# Altium schematic sheet Pinto.SchDoc
size A; SheetNumber: 1; SheetTotal: 2
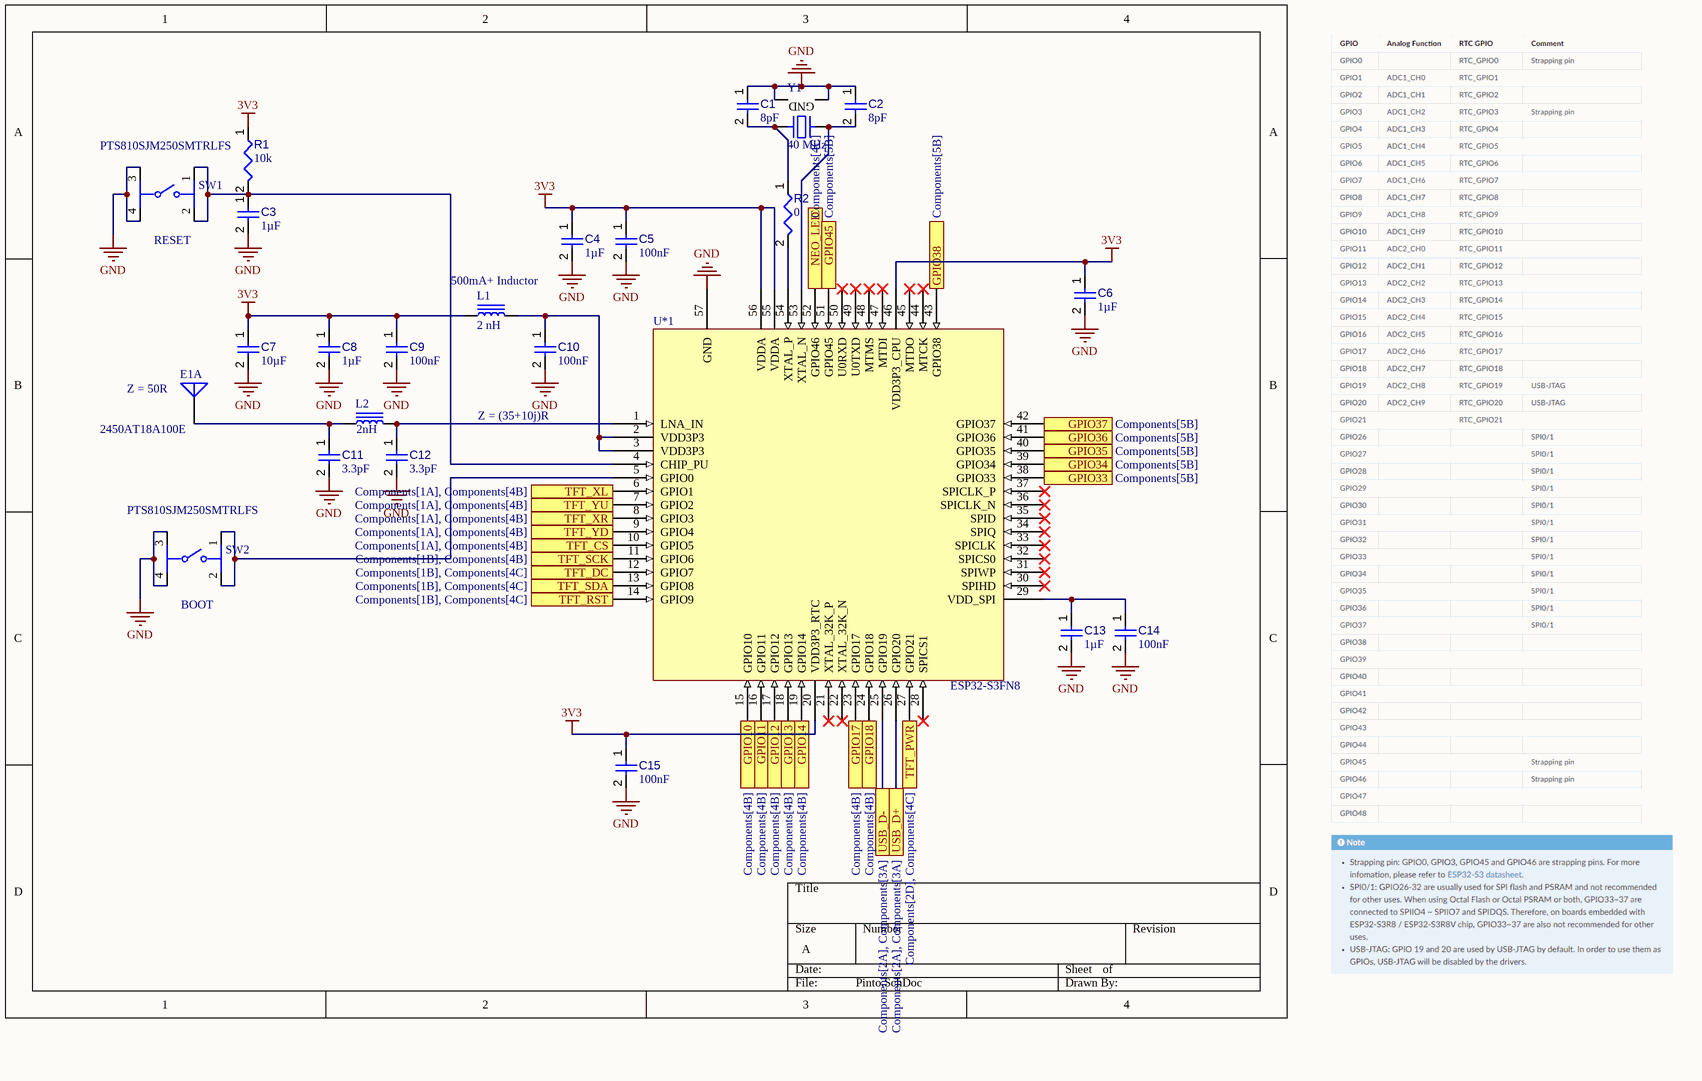
[diagram p0: Pinto.SchDoc]

## Parts
C1  value 8pF  [CAPC0402(1005)33_L]  (hidden comment: Capacitor 12pF +/-10% 50V 0402)
C2  value 8pF  [CAPC0402(1005)33_L]  (hidden comment: Capacitor 12pF +/-10% 50V 0402)
C3  value 1µF  [CAPC0402(1005)60_L]  (hidden comment: Capacitor 1µF +/-20% 10V 0402)
C4  value 1µF  [CAPC0402(1005)60_L]  (hidden comment: Capacitor 1µF +/-20% 10V 0402)
C5  value 100nF  [CAPC0402(1005)60_L]  (hidden comment: Capacitor 100nF +/-20% 10V 0402)
C6  value 1µF  [CAPC0402(1005)60_L]  (hidden comment: Capacitor 1µF +/-20% 10V 0402)
C7  value 10µF  [CAPC0402(1005)60_L]  (hidden comment: Capacitor 10µF +/-40% 6.3V 0402)
C8  value 1µF  [CAPC0402(1005)60_L]  (hidden comment: Capacitor 1µF +/-20% 10V 0402)
C9  value 100nF  [CAPC0402(1005)60_L]  (hidden comment: Capacitor 100nF +/-20% 10V 0402)
C10  value 100nF  [CAPC0402(1005)60_L]  (hidden comment: Capacitor 100nF +/-20% 10V 0402)
C11  value 3.3pF  [CAPC1005X56X25LL10T15]  (hidden comment: Capacitor 0.1 uF +/- 5% 16 V 0402)
C12  value 3.3pF  [CAPC1005X56X25LL10T15]  (hidden comment: Capacitor 0.1 uF +/- 5% 16 V 0402)
C13  value 1µF  [CAPC0402(1005)60_L]  (hidden comment: Capacitor 1µF +/-20% 10V 0402)
C14  value 100nF  [CAPC0402(1005)60_L]  (hidden comment: Capacitor 100nF +/-20% 10V 0402)
C15  value 100nF  [CAPC0402(1005)60_L]  (hidden comment: Capacitor 100nF +/-20% 10V 0402)
E1  2450AT18A100E  [JT-2450AT18A100-2_V]  (part A of 2)
L1  2 nH  [IND 0201_0603]
L2  2nH  [IND 0201_0603]
R1  value 10k  [RESC0402(1005)_L]  (hidden comment: 10KR2F)
R2  value 0  [RESC0402(1005)_L]  (hidden comment: 0R2J)
SW1  PTS810SJM250SMTRLFS  [FP-PTS810SJM250SMTRLFS-MFG]
SW2  PTS810SJM250SMTRLFS  [FP-PTS810SJM250SMTRLFS-MFG]
U*1  ESP32-S3FN8  [PCBComponent_1]
Y1  40 MHz  [NDK NX3225SA]

## Ports
GPIO10 (see Components[4B]), GPIO11 (see Components[4B]), GPIO12 (see Components[4B]), GPIO13 (see Components[4B]), GPIO14 (see Components[4B]), GPIO17 (see Components[4B]), GPIO18 (see Components[4B]), GPIO33 (see Components[5B]), GPIO34 (see Components[5B]), GPIO35 (see Components[5B]), GPIO36 (see Components[5B]), GPIO37 (see Components[5B]), GPIO38 (see Components[5B]), GPIO45 (see Components[5B]), NEO_LED (see Components[4C]), TFT_CS (see Components[1A], Components[4B]), TFT_DC (see Components[1B], Components[4C]), TFT_PWR (see Components[2D], Components[4C]), TFT_RST (see Components[1B], Components[4C]), TFT_SCK (see Components[1B], Components[4B]), TFT_SDA (see Components[1B], Components[4C]), TFT_XL (see Components[1A], Components[4B]), TFT_XR (see Components[1A], Components[4B]), TFT_YD (see Components[1A], Components[4B]), TFT_YU (see Components[1A], Components[4B]), USB_D+ (see Components[2A], Components[3A]), USB_D- (see Components[2A], Components[3A])

## Nets
3V3: C4.1 C5.1 C6.1 C7.1 C8.1 C9.1 C15.1 L1.1 R1.1 U*1.20(VDD3P3_RTC) U*1.46(VDD3P3_CPU) U*1.55(VDDA) U*1.56(VDDA)
GND: C1.1 C2.1 C3.2 C4.2 C5.2 C6.2 C7.2 C8.2 C9.2 C10.2 C11.2 C12.2 C13.2 C14.2 C15.2 SW1.3 SW1.4 SW2.3 SW2.4 U*1.57(GND) Y1.2(GND) Y1.4(GND)
GPIO10: U*1.15(GPIO10) ; port GPIO10
GPIO11: U*1.16(GPIO11) ; port GPIO11
GPIO12: U*1.17(GPIO12) ; port GPIO12
GPIO13: U*1.18(GPIO13) ; port GPIO13
GPIO14: U*1.19(GPIO14) ; port GPIO14
GPIO17: U*1.23(GPIO17) ; port GPIO17
GPIO18: U*1.24(GPIO18) ; port GPIO18
GPIO33: U*1.38(GPIO33) ; port GPIO33
GPIO34: U*1.39(GPIO34) ; port GPIO34
GPIO35: U*1.40(GPIO35) ; port GPIO35
GPIO36: U*1.41(GPIO36) ; port GPIO36
GPIO37: U*1.42(GPIO37) ; port GPIO37
GPIO38: U*1.43(GPIO38) ; port GPIO38
GPIO45: U*1.51(GPIO45) ; port GPIO45
NEO_LED: U*1.52(GPIO46) ; port NEO_LED
TFT_CS: U*1.10(GPIO5) ; port TFT_CS
TFT_DC: U*1.12(GPIO7) ; port TFT_DC
TFT_PWR: U*1.27(GPIO21) ; port TFT_PWR
TFT_RST: U*1.14(GPIO9) ; port TFT_RST
TFT_SCK: U*1.11(GPIO6) ; port TFT_SCK
TFT_SDA: U*1.13(GPIO8) ; port TFT_SDA
TFT_XL: U*1.6(GPIO1) ; port TFT_XL
TFT_XR: U*1.8(GPIO3) ; port TFT_XR
TFT_YD: U*1.9(GPIO4) ; port TFT_YD
TFT_YU: U*1.7(GPIO2) ; port TFT_YU
USB_D+: U*1.26(GPIO20) ; port USB_D+
USB_D-: U*1.25(GPIO19) ; port USB_D-
NetC1_2: C1.2 R2.1 Y1.3
NetC2_2: C2.2 U*1.53(XTAL_N) Y1.1
NetC3_1: C3.1 R1.2 SW1.1 SW1.2 U*1.4(CHIP_PU)
NetC10_1: C10.1 L1.2 U*1.2(VDD3P3) U*1.3(VDD3P3)
NetC11_1: C11.1 E1.1(FP) L2.1
NetC12_1: C12.1 L2.2 U*1.1(LNA_IN)
NetC13_1: C13.1 C14.1 U*1.29(VDD_SPI)
NetR2_2: R2.2 U*1.54(XTAL_P)
NetSW2_1: SW2.1 SW2.2 U*1.5(GPIO0)

Not connected (* = marked no-connect by the designer): U*1 21(XTAL_32K_P)* 22(XTAL_32K_N)* 28(SPICS1)* 30(SPIHD)* 31(SPIWP)* 32(SPICS0)* 33(SPICLK)* 34(SPIQ)* 35(SPID)* 36(SPICLK_N)* 37(SPICLK_P)* 44(MTCK)* 45(MTDO)* 47(MTDI)* 48(MTMS)* 49(U0TXD)* 50(U0RXD)*

## Notes on the sheet
- (near SW1) RESET
- 500mA+ Inductor
- (near E1) Z = 50R
- Z = (35+10j)R
- (near SW2) BOOT

## Library data of the parts
C1 C2 = CMP-001-00072-4: Chip Capacitor, 12pF +/-10%, 50V, 0402, Thickness 0.33 mm; Tolerance: 20%; Pins: 2; Max Operating Temperature: 85°C; Case/Package: 0402; Voltage Rating: 50V; Mounting Technology: SMT; Min Operating Temperature: -55°C
C3 C4 C6 C8 C13 = CMP-001-00063-3: Chip Capacitor, 1µF +/-20%, 10V, 0402, Thickness 0.6 mm; Tolerance: 10%; Mounting Technology: SMT; Max Operating Temperature: 85°C; Voltage Rating: 10V; Pins: 2; Case/Package: 0402; Min Operating Temperature: -55°C
C5 C9 C10 C14 C15 = CMP-001-00061-3: Chip Capacitor, 100nF +/-20%, 10V, 0402, Thickness 0.6 mm; Tolerance: 20%; Mounting Technology: SMT; Voltage Rating: 10V; Max Operating Temperature: 85°C; Pins: 2; Case/Package: 0402; Min Operating Temperature: -55°C
C7 = CMP-001-00074-3: Chip Capacitor, 10µF +/-40%, 6.3V, 0402, Thickness 0.6 mm; Tolerance: 10%; Case/Package: 0402; Pins: 2; Mounting Technology: SMT; Voltage Rating: 6.3V; Max Operating Temperature: 85°C; Min Operating Temperature: -55°C
C11 C12 = CMP-001-00001-6: Chip Capacitor, 0.1 uF, +/- 5%, 16 V, 0402 (1005 Metric); Capacitor Type: Ceramic; Voltage Rating: 16V; Max Operating Temperature: 125°C; Min Operating Temperature: -55°C; Case/Package: 0402; Mounting Technology: SM; Pins: 2; Tolerance: 5%; RoHS Compliant: True
E1 = CMP-2000-05167-1: Ceramic Antenna, 2.45 GHZ, 2 W, -40 to 125 degC, 2-Pin SMD, RoHS, Tape and Reel; Manufacturer: Johanson Technology; Maximum Frequency: 2500MHz; Typical Antenna Gain: 0.5dB; Minimum Frequency: 2400MHz; Manufacturer URL: https://www.johansontechnology.com/; Type: Ceramic; Datasheet Version: Rev. 1.3, 07/2014; Category: Antenna; Package: 2Case18-4; Datasheet URL: http://www.johansontechnology.com/datasheets/antennas/2450AT18A100.pdf
L1 L2 = WLCM0603TGB2N0TB: INDUCTOR FIXED 2.0NH 0201; Manufacturer: Walsin Technology Corporation; Current Rating (Amps): 450 mA; DC Resistance (DCR): 200mOhm Max; Frequency - Self Resonant: 12.5GHz; Inductance Frequency - Test: 500 MHz; Material - Core: Ceramic; Q @ Freq: 12 @ 500MHz; Shielding: Unshielded; Tolerance: ±0.1nH; Type: Multilayer; Part Number: WLCM0603TGB2N0TB; ComponentLink1Description: Datasheet; ComponentLink1URL: https://www.passivecomponent.com/wp-content/uploads/inductor/WLCM0603TG_Series.pdf; ComponentLink2Description: DigiKey Link; ComponentLink2URL: https://www.digikey.com/en/products/detail/walsin-technology-corporation/WLCM0603TGB2N0TB/14563834; Device Package: 0201 (0603 Metric); Height - Seated (Max): 0.013" (0.33mm); Inductance: 2 nH; LastUpdated: 1/2/2023 9:01:21 PM; Lifecycle Status: Active; Minimum Order: 1; Mounting Type: Surface Mount; Operating Temperature: -55°C ~ 125°C; Package / Case: 0201 (0603 Metric); Packaging: CutTape; PartId: 3830; Part Status: Active; Price: 0.01; Series: CM; Size / Dimension: 0.024" L x 0.012" W (0.60mm x 0.30mm); Supplier 1: DigiKey; Supplier Part Number 1: 1292-WLCM0603TGB2N0TBCT-ND; Supplier Device Package: 0201; Value: 2 nH
R1 = CMP-009-00066-2: 10K 0.063W 1% 0402 (1005 Metric)  SMD; Power: 63mW; Case/Package: 0402; Mounting Technology: SMT; Pins: 2; Tolerance: 1%
R2 = CMP-009-00062-2: Jumper 0402 (1005 Metric); Pins: 2; Mounting Technology: SMT; Case/Package: 0402
SW1 SW2 = CMP-10040-000001-2: SWITCH TACTILE SPST-NO 0.05A 16V; Throw Configuration: SPST; Operating Force: 160gf; Actuator Type: Standard; Switch Travel: 0.15mm; Switch Function: Off-Mom; Max Current Rating: 50mA; Mechanical Life: 150000Cycles; Illumination Type: Non-Illuminated; Package Quantity: 2900; Depth: 4.6mm; Mount: Surface Mount; Packaging: Tape and Reel; Length: 3.2mm; RoHS Compliant: Yes; Case/Package: SMD/SMT; Voltage Rating (DC): 16V; Min Operating Temperature: -40°C; Termination: J-Bend; Lead Free: Lead Free; Contact Plating: Silver; Orientation: Straight; Max Operating Temperature: 85°C; Current Rating: 50mA; Color: Black
U*1 = ESP32-S3FN8: ESP32 MCU
Y1 = NX3225SA-40M-EXS00A-CS03880: CRYSTAL 40.0000MHZ 10PF SMD; Manufacturer: NDK America, Inc.; ESR (Equivalent Series Resistance): 50 Ohms; Frequency Stability: ±17ppm; Frequency Tolerance: ±10ppm; Operating Mode: Fundamental; Part Number: NX3225SA-40M-EXS00A-CS03880; ComponentLink1Description: Datasheet; ComponentLink1URL: //media.digikey.com/pdf/Data%20Sheets/NDK%20PDFs/NX3225SA-40M-EXS00A-CS03880.pdf; ComponentLink2Description: DigiKey Link; ComponentLink2URL: https://www.digikey.com/en/products/detail/ndk-america-inc/NX3225SA-40M-EXS00A-CS03880/5015625; Frequency: 40 MHz; Height - Seated (Max): 0.024" (0.60mm); LastUpdated: 1/2/2023 8:58:25 PM; Lifecycle Status: Active; Load Capacitance: 10pF; Minimum Order: 1; Mounting Type: Surface Mount; Operating Temperature: -40°C ~ 85°C; Package / Case: 4-SMD, No Lead; Packaging: TapeAndReel; PartId: 586; Part Status: Active; Price: 0.36; Series: NX3225SA; Size / Dimension: 0.126" L x 0.098" W (3.20mm x 2.50mm); Supplier 1: DigiKey; Supplier Part Number 1: 644-1249-1-ND; Type: MHz Crystal; Value: 40 MHz